# Altium schematic sheet SMD JST 2P.schdoc
size 124 x 99 mm
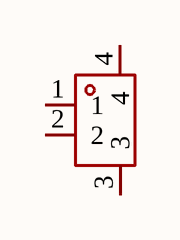
[diagram p0: SMD JST 2P.schdoc]

## Parts
U?  BX-HA2.54-2PWT  [CONN-SMD_2P-P2.50_ZX-HA2.54-2PWT]  (value not drawn)

## Nets

Not connected (* = marked no-connect by the designer): U? 1 2 3 4

## Library data of the parts
U? = BX-HA2.54-2PWT: Manufacturer: Bossie(博锡); Add into BOM: yes; Pins Structure: 1x2P; Pitch: 2.54mm; Number of PINs Per Row: 2; Current Rating (Max): 3A; Symbol: BX-HA2.54-2PWT; Device: BX-HA2.54-2PWT; LCSC Part Name: 1x2P 间距:2.54mm 卧贴; Supplier Part: C18077806; Manufacturer Part: BX-HA2.54-2PWT; Supplier Footprint: SMD,P=2.54mm,卧贴; JLCPCB Part Class: Extended Part; Datasheet: https://atta.szlcsc.com/upload/public/pdf/source/20231017/0F5BE3E474C97FE56F69CCCD4551F1BC.pdf; Supplier: LCSC; Convert to PCB: yes; Mounting Style: 卧贴; Reference Series: -; Number of Pins: 2P; Number of Rows: 1; Row Spacing: -; Contact Material: Brass; Contact Plating: Tin; Operating Temperature Range: -25℃~+85℃